# Altium schematic sheet BoostConverter.SchDoc
size A4
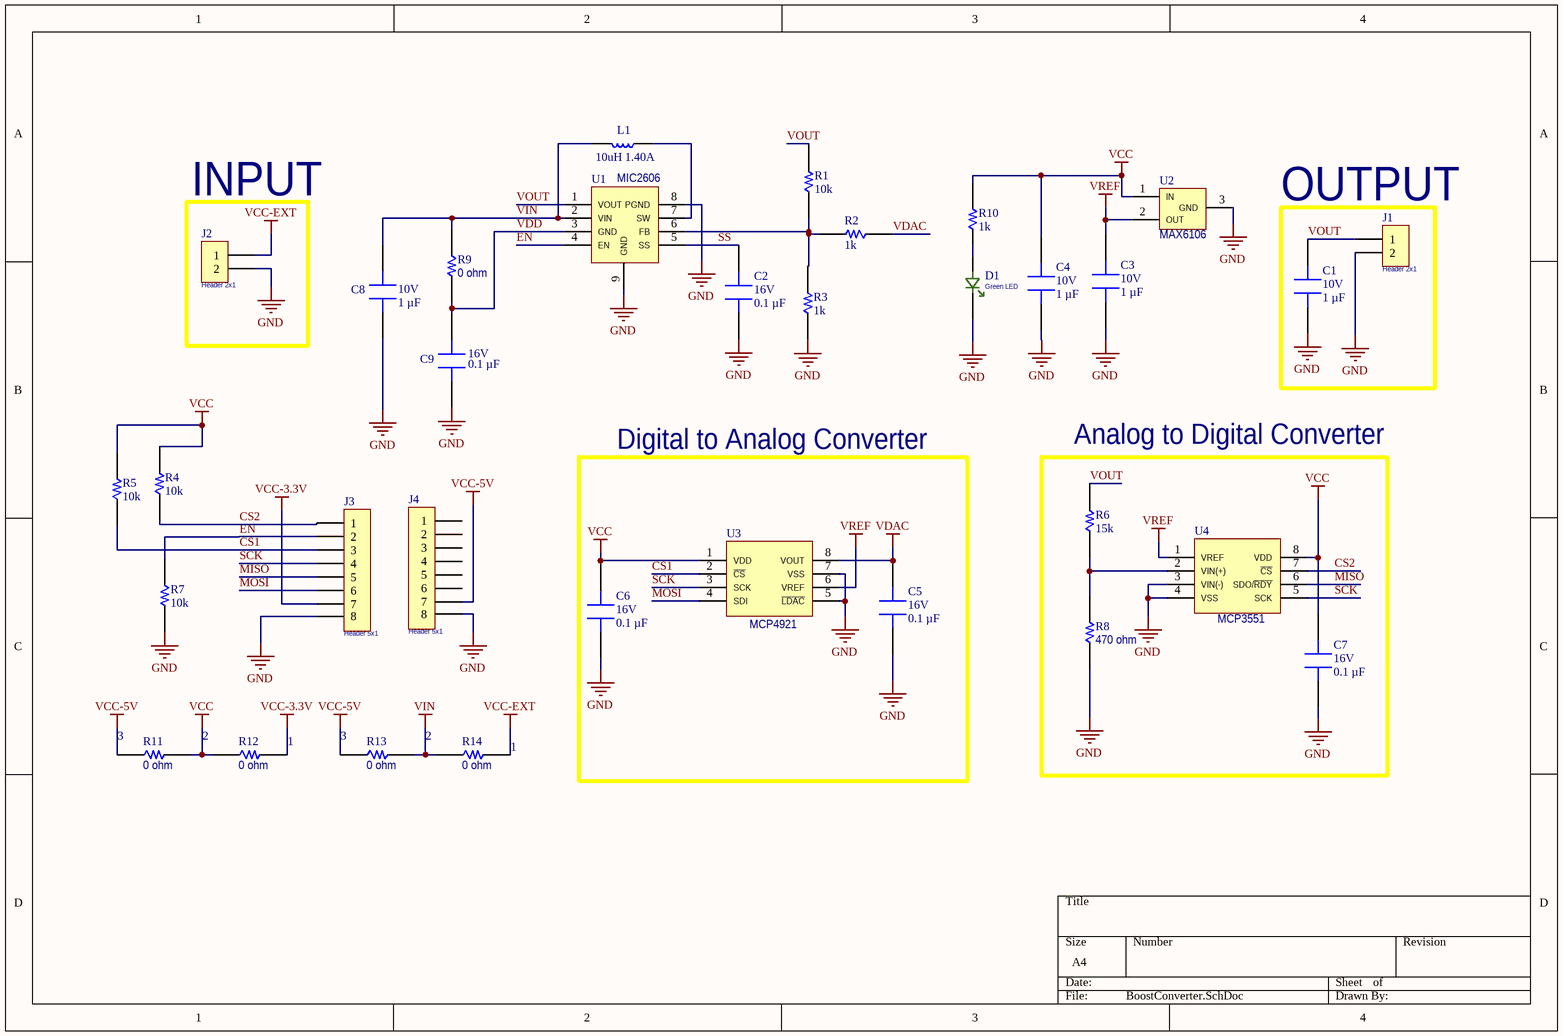
[diagram p0: BoostConverter.SchDoc]

## Parts
C1  value 1 µF  Voltage: 10V  [C0603-N]  (hidden comment: ANCAP110040340E0000)
C2  value 0.1 µF  Voltage - Rated: 16V  [C0603-N]  (hidden comment: ANCAP0UF1006030412)
C3  value 1 µF  Voltage: 10V  [C0603-N]  (hidden comment: ANCAP110040340E0000)
C4  value 1 µF  Voltage: 10V  [C0603-N]  (hidden comment: ANCAP110040340E0000)
C5  value 0.1 µF  Voltage: 16V  [C0603-N]  (hidden comment: ANCAP0UF1006030412)
C6  value 0.1 µF  Voltage: 16V  [C0603-N]  (hidden comment: ANCAP0UF1006030412)
C7  value 0.1 µF  Voltage: 16V  [C0603-N]  (hidden comment: ANCAP0UF1006030412)
C8  value 1 µF  Voltage: 10V  [C0603-N]  (hidden comment: ANCAP110040340E0000)
C9  value 0.1 µF  Voltage: 16V  [C0603-N]  (hidden comment: ANCAP0UF1006030412)
D1  value Green LED  [QTLP601C4TR-0603]  (hidden comment: ANLEDQTLP601C4TR00)
J1  Name: Header 2x1  [796911-2]  (hidden comment: ANCON02202P1757242)
J2  Name: Header 2x1  [796911-2]  (hidden comment: ANCON02202P1757242)
J3  value Header 5x1  [8POS]  (hidden comment: ANCON2000824000000)
J4  value Header 5x1  [8POS]  (hidden comment: ANCON2000824000000)
L1  value 10uH 1.40A  [SRU5028]  (hidden comment: ANIND10UH001A40009)
R1  value 10k  [0603-N]  (hidden comment: ANRES10K006031T700)
R2  value 1k  [0603-N]  (hidden comment: ANRES1K0006033BC00)
R3  value 1k  [0603-N]  (hidden comment: ANRES1K0006033BC00)
R4  value 10k  [0603-N]  (hidden comment: ANRES10K006031T700)
R5  value 10k  [0603-N]  (hidden comment: ANRES10K006031T700)
R6  value 15k  [0805-N]  (hidden comment: ANRESE240215030000)
R7  value 10k  [0603-N]  (hidden comment: ANRES10K006031T700)
R8  value 470 ohm  [0603-N]  (hidden comment: ANRESE240147010000)
R9  value 0 ohm  [0402-N]  (hidden comment: ANRESE240000000000)
R10  value 1k  [0603-N]  (hidden comment: ANRES1K0006033BC00)
R11  value 0 ohm  [0402-N]  (hidden comment: ANRESE240000000000)
R12  value 0 ohm  [0402-N]  (hidden comment: ANRESE240000000000)
R13  value 0 ohm  [0402-N]  (hidden comment: ANRESE240000000000)
R14  value 0 ohm  [0402-N]  (hidden comment: ANRESE240000000000)
U1  Name: MIC2606  [MIC2606YML-TR]  (hidden comment: ANICMIC2606YMLTR00)
U2  Name: MAX6106  [MAX6106EUR+T]  (hidden comment: ANICMAX6106EURTTRN)
U3  Name: MCP4921  [MCP4921T-E/SN]  (hidden comment: ANICMCP4921EMCND00)
U4  Name: MCP3551  [MCP3551-E/SN]  (hidden comment: ANICMCP3551ESNND00)

## Blocks framed on the sheet
INPUT: J2
OUTPUT: C1 J1
Digital to Analog Converter: C5 C6 U3
Analog to Digital Converter: C7 R6 R8 U4

## Nets
GND: C1.1 C2.1 C3.2 C4.2 C5.1 C6.1 C7.1 C8.2 C9.2 D1.2 J1.2 J2.2 J3.8 J4.8 R3.1 R7.2 R8.1 U1.8(PGND) U1.9(GND) U2.3(GND) U3.5(~{LDAC}) U3.7(VSS) U4.3(VIN(-)) U4.4(VSS)
VCC: C4.1 C6.2 C7.2 R4.2 R5.2 R10.2 R11.2 R12.1 U2.1(IN) U3.1(VDD) U4.8(VDD)
VCC-3.3V: J3.7 R12.2
VCC-5V: J4.7 R11.1 R13.1
VCC-EXT: J2.1 R14.2
VDAC: C5.2 R2.1 U3.8(VOUT)
VIN: C8.1 L1.2 R9.1 R13.2 R14.1 U1.2(VIN)
VREF: C3.1 U2.2(OUT) U3.6(VREF) U4.1(VREF)
CS1: J3.3 R5.1 U3.2(~{CS})
CS2: J3.1 R4.1 U4.7(~{CS})
EN: J3.2 R7.1 U1.4(EN)
MISO: J3.5 U4.6(SDO/~{RDY})
MOSI: J3.6 U3.4(SDI)
SCK: J3.4 U3.3(SCK) U4.5(SCK)
SS: C2.2 U1.5(SS)
VDD: C9.1 R9.2 U1.3(GND)
VOUT: C1.2 J1.1 R1.2 R6.2 U1.1(VOUT)
NetD1_1: D1.1 R10.1
NetL1_1: L1.1 U1.7(SW)
NetR1_1: R1.1 R2.2 R3.2 U1.6(FB)
NetR6_1: R6.1 R8.2 U4.2(VIN(+))

Not connected (* = marked no-connect by the designer): J4 1 2 3 4 5 6

## Notes on the sheet
- (near R11) 3
- 2
- (near R12) 1
- (near R13) 3
- (near R14) 1

## Library data of the parts
C1 C3 C4 C8 = CL10A105KP8NNNC: CAP CER 1UF 10V X5R 0603; Manufacturer: Samsung Electro-Mechanics; Order Number: CL10A105KP8NNNC; Operating Temperature: -55°C ~ 85°C; Digi-Key Part Number: 1276-1182-2-ND; Parameter 8: *; Parameter 9: *
C2 C5-C7 C9 = 0603YC104JAT2A: 0.10µF ±5% 16V Ceramic Capacitor X7R 0603 (1608 Metric); Manufacturer: KYOCERA AVX; Order Number: 0603YC104JAT2A; Operating Temperature: -55°C ~ 125°C; Digi-Key Part Number: 478-3726-2-ND; Parameter 8: *; Parameter 9: *
D1 = QTLP601C4TR: Green 570nm LED Indication - Discrete 2.1V 0603 (1608 Metric); Manufacturer: Everlight Electronics Co Ltd; Current - Test: 20 mA; Voltage - Forward (Vf) (Typ): 2.1 V; Digi-Key Part Number: 1080-1405-2-ND
J1 J2 = 796911-2: TERM BLK 2P SIDE ENT 5.08MM PCB; Manufacturer: Phoenix Contact; Value: 2POS 90DEG 5.08MM; Voltage: 300 V; Current: 17.5 A; Digi-Key Part Number: A121381-ND
J3 J4 = PH1-08-UA: 8 POS HEADER; Manufacturer: Adam Tech; Voltage Rating: 250V; Current Rating: 3 A; Digi-Key Part Number: 2057-PH1-08-UA-ND
L1 = SRU5028-100Y: 10uH, 1.40A, -40C +125C, SRU5028-100Y; Manufacturer: Bourns Inc.; Current Rating: 1.8 A; Digi-Key Part Number: SRU5028-100YTR-ND; Operating Temperature: -40°C ~ 125°C
R1 R5 = RC0603FR-0710KL: 10K 1/10W 5% 0603; Manufacturer: YAGEO; Detailed Description: 10 kOhms ±1% 0.1W, 1/10W Chip Resistor 0603 (1608 Metric) Moisture Resistant Thick Film; Digi-Key Part Number: 311-10.0KHRTR-ND; Operating Temperature: -55°C ~ 155°C
R2 R3 R10 = CRCW06031K00FKEAHP: RES SMD 1K OHM 1% 1/3W 0603; Manufacturer: Vishay Dale; Detailed Description: 1 kOhms ±1% 0.333W, 1/3W Chip Resistor 0603 (1608 Metric) Automotive AEC-Q200, Pulse Withstanding Thick Film; Digi-Key Part Number: 541-1.00KSTR-ND; Operating Temperature: -55°C ~ 155°C
R4 R7 = RC0603FR-0710KL: 10K 1/10W 5% 0603; Manufecturer: YAGEO; Detailed Description: 10 kOhms ±1% 0.1W, 1/10W Chip Resistor 0603 (1608 Metric) Moisture Resistant Thick Film; Digi-Key Part Number: 311-10.0KHRTR-ND; Operating Temperature: -55°C ~ 155°C
R6 = ERJ-6ENF1502V: E24, 15K, 0805, %1; Manufacturer: Panasonic - ECG; Detailed Description: 15 kOhms ±1% 0.125W, 1/8W Chip Resistor 0805 (2012 Metric) Automotive AEC-Q200 Thick Film; Digi-Key Part Number: P15.0KCTR-ND; Operating Temperature: -55°C ~ 155°C
R8 = ERJ-3EKF4700V: E24, 470R, 0603, %1; Manufacturer: Panasonic Electronic Components; Detailed Description: 470 Ohms ±1% 0.1W, 1/10W Chip Resistor 0603 (1608 Metric) Automotive AEC-Q200 Thick Film; Digi-Key Part Number: P470HTR-ND; Operating Temperature: -55°C ~ 155°C; Manufecturer Product Number: ERJ-3EKF4700V
R9 R11 R13 R14 = 6-1622826-4: 0R, 0402, Thick Film, 1/16W, %1; Manufacturer: TE Connectivity Passive Product; Manufecturer Part Number: CRG0402ZR; Detailed Description: 0 Ohms Jumper 0.063W, 1/16W Chip Resistor 0402 (1005 Metric) Thick Film; Digi-Key Part Number: A106025TR-ND; Operating Temperature: -55°C ~ 155°C
R12 = 6-1622826-4: 0R, 0402, Thick Film, 1/16W, %1; Manufecturer: TE Connectivity Passive Product; Manufecturer Part Number: CRG0402ZR; Detailed Description: 0 Ohms Jumper 0.063W, 1/16W Chip Resistor 0402 (1005 Metric) Thick Film; Digi-Key Part Number: A106025TR-ND; Operating Temperature: -55°C ~ 155°C
U1 = MIC2606YML-TR: IC REG BOOST ADJ 500MA 8MLF; Manufacturer: Microchip Technology; Current - Output: 500mA (Switch); Voltage - Output (Min/Fixed): 4.5V; Operating Temperature: -40°C ~ 125°C (TJ)
U2 = MAX6106EUR+T: IC VREF SERIES 0.4% SOT23-3; Manufacturer: Analog Devices Inc./Maxim Integrated; Current - Output: 5mA; Voltage - Output (Min/Fixed): 2.048V; Operating Temperature: -40°C ~ 85°C (TA)
U3 = MCP4921T-E/SN: IC DAC 12BIT V-OUT 8DFN; Manufacturer: Microchip Technology; Voltage - Supply, Analog/Digital: 2.7V ~ 5.5V; Input Type: Differential; Number of Bits: 12; Operating Temperature: -40°C ~ 125°C; Digi-Key Part Number: MCP4921T-E/SNTR-ND
U4 = MCP3551-E/SN: IC ADC 22BIT SIGMA-DELTA 8SOIC; Manufacturer: Microchip Technology; Voltage - Supply, Analog/Digital: 2.7V ~ 5.5V; Input Type: Differential; Operating Temperature: -40°C ~ 125°C